# EAGLE design Display (EAGLE 7.1.0)
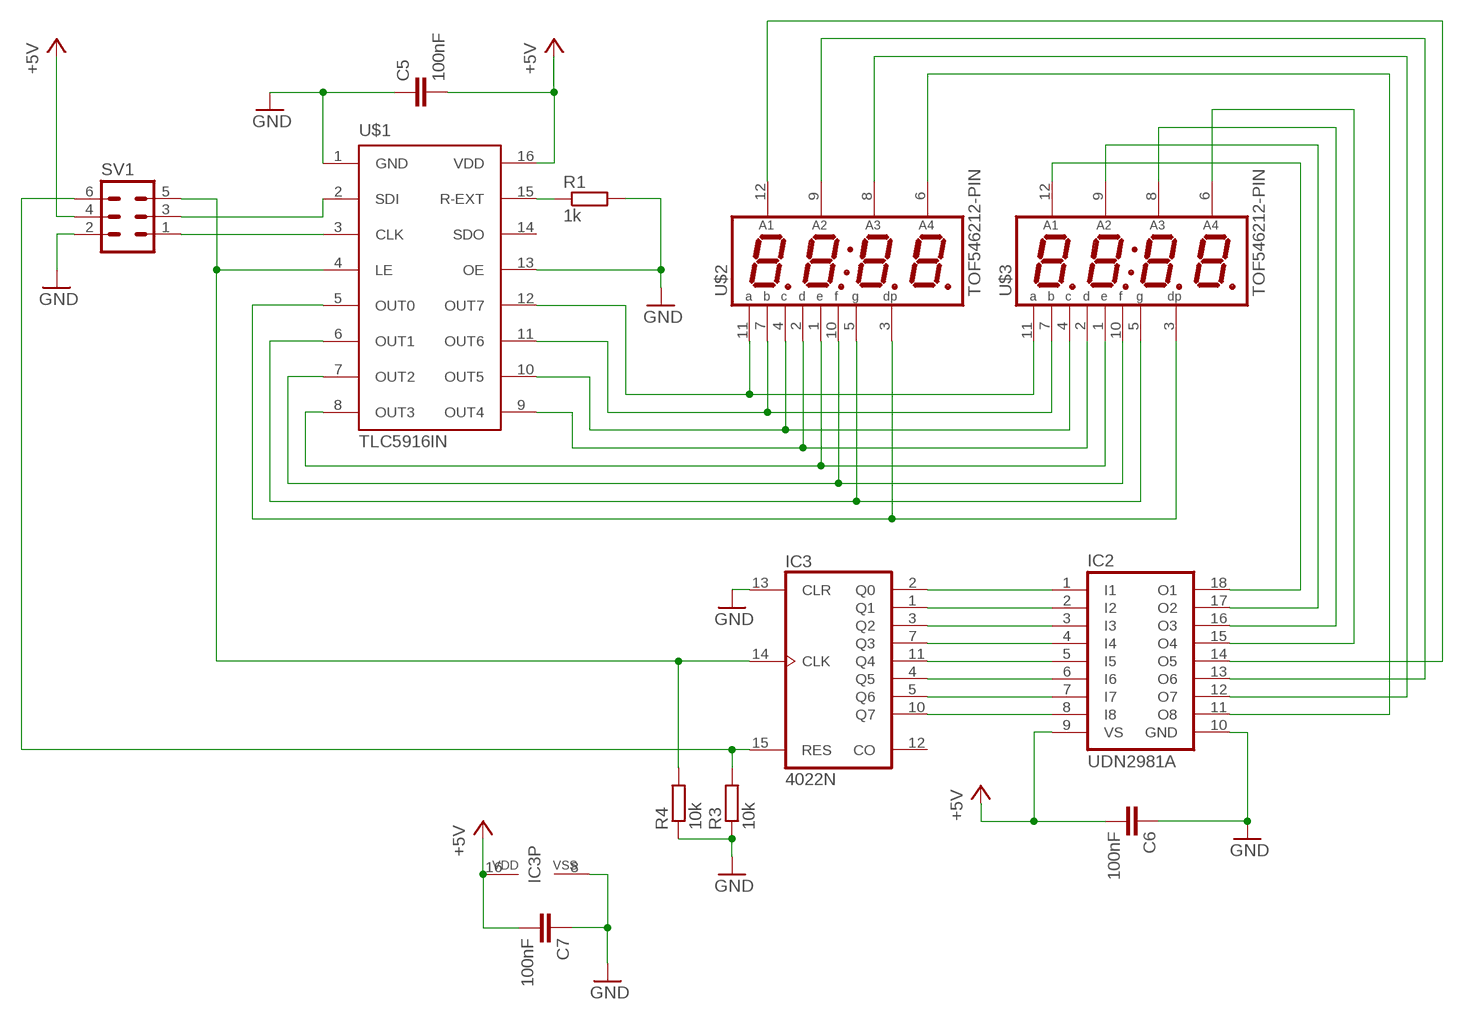
[diagram p0: schematic, sheet 1]

## Parts
C5  100nF  C-EU025-024X044  [C025-024X044]
C6  100nF  C-EU025-024X044  [C025-024X044]
C7  100nF  C-EU025-024X044  [C025-024X044]
IC2  UDN2981A  [DIL18]
IC3  4022N  [DIL16]
R1  1k  R-EU_0204/7  [0204/7]
R3  10k  R-EU_0204/2V  [0204V]
R4  10k  R-EU_0204/2V  [0204V]
SV1  ML6L  [ML6L]
U$1  TLC5916IN  [DIL16]
U$2  TOF546212-PIN  [TOF5462*]
U$3  TOF546212-PIN  [TOF5462*]

## Nets
+5V: C5.2 C6.2 C7.2 IC2.9(VS) IC3.16(VDD) SV1.4 U$1.16(VDD)
CLOCK: SV1.1 U$1.3(CLK)
DATA: SV1.3 U$1.2(SDI)
GND: C5.1 C6.1 C7.1 IC2.10(GND) IC3.8(VSS) IC3.13(CLR) R1.2 R3.1 R4.1 SV1.2 U$1.1(GND) U$1.13(OE)
LATCH: IC3.14(CLK) R4.2 SV1.5 U$1.4(LE)
N$1: U$1.11(OUT6) U$2.7(B) U$3.7(B)
N$2: IC2.17(O2) U$3.9(A2)
N$3: U$1.10(OUT5) U$2.4(C) U$3.4(C)
N$4: U$1.9(OUT4) U$2.2(D) U$3.2(D)
N$5: R1.1 U$1.15(R-EXT)
N$6: U$1.8(OUT3) U$2.1(E) U$3.1(E)
N$7: U$1.7(OUT2) U$2.10(F) U$3.10(F)
N$8: U$1.6(OUT1) U$2.5(G) U$3.5(G)
N$9: U$1.5(OUT0) U$2.3(DP) U$3.3(DP)
N$10: IC2.1(I1) IC3.2(Q0)
N$11: IC2.2(I2) IC3.1(Q1)
N$12: IC2.3(I3) IC3.3(Q2)
N$13: IC2.4(I4) IC3.7(Q3)
N$14: IC2.5(I5) IC3.11(Q4)
N$15: IC2.6(I6) IC3.4(Q5)
N$16: IC2.7(I7) IC3.5(Q6)
N$17: IC2.8(I8) IC3.10(Q7)
N$18: IC2.18(O1) U$3.12(A1)
N$19: IC2.14(O5) U$2.12(A1)
N$20: U$1.12(OUT7) U$2.11(A) U$3.11(A)
N$21: IC2.13(O6) U$2.9(A2)
N$22: IC2.16(O3) U$3.8(A3)
N$23: IC2.12(O7) U$2.8(A3)
N$24: IC2.15(O4) U$3.6(A4)
N$25: IC2.11(O8) U$2.6(A4)
RESET: IC3.15(RES) R3.2 SV1.6
Unconnected: IC3.12(CO) U$1.14(SDO)

## Library data of the parts
C5-C7 = rcl:C-EU: CAPACITOR, European symbol
IC2 = uln-udn:UDN298*: DRIVER ARRAY Source: Allegro Microsystems Inc. / UDN2981-UDN2984.pdf
IC3 = 40xx:4022: Divide-by 8 COUNTER
R1 R3 R4 = rcl:R-EU_: RESISTOR, European symbol
SV1 = con-harting-ml:ML6: HARTING; OC_FARNELL: unknown; OC_NEWARK: unknown
U$1 = zlalanne:TLC5916: TLC5916 8-Channel Constant-Current LED Sink Drivers Datasheet <http://www.ti.com/lit/ds/symlink/tlc5916.pdf>
U$2 U$3 = TOF5462:TOF5462

## Board
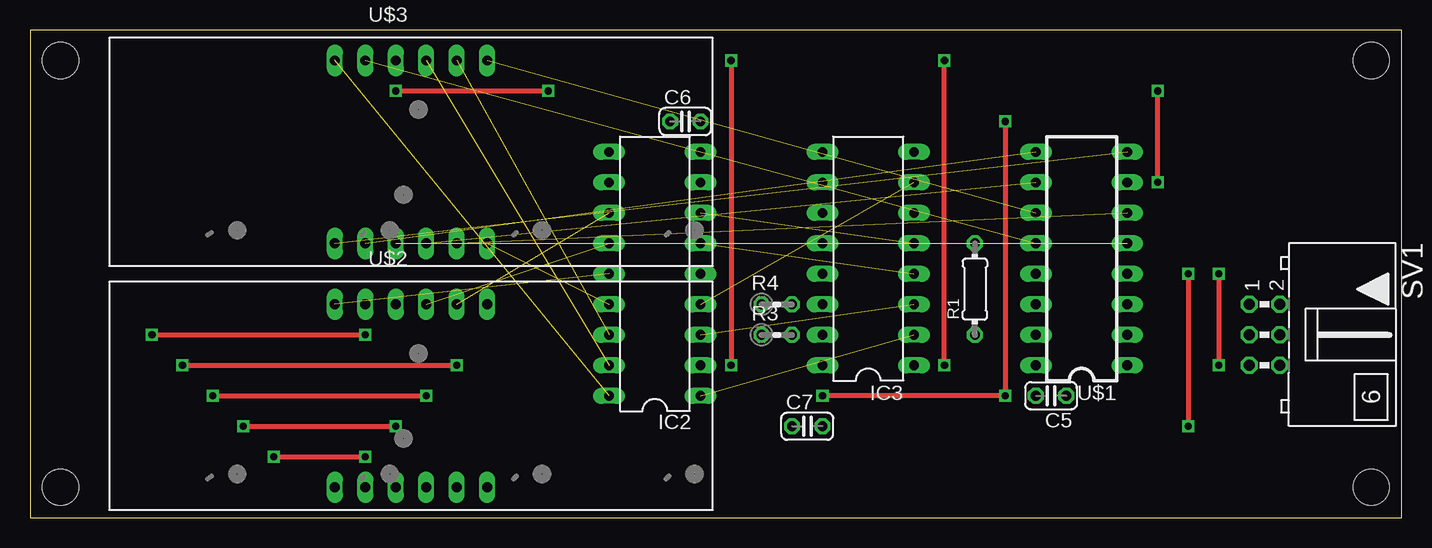
[diagram p1: board, top side]
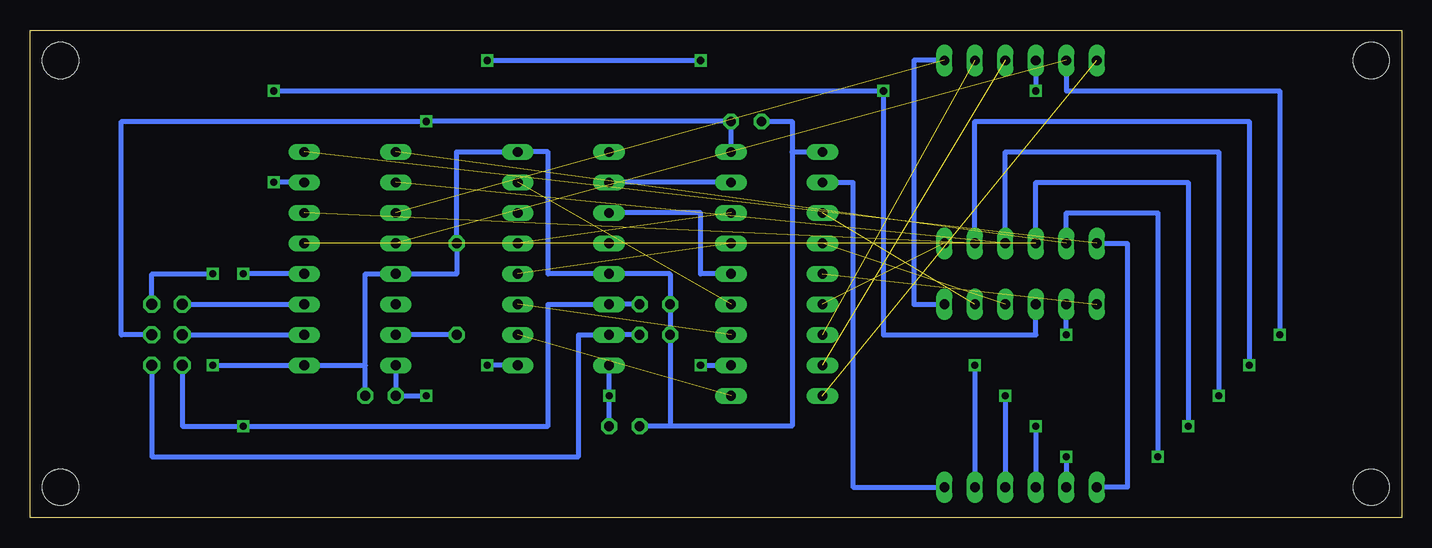
[diagram p2: board, bottom side, seen from below]

Size 114.3 x 40.64 mm. Coordinates in mm from the lower left corner, seen from the top.
Outline: 0,0 114.3,0 114.3,40.64 0,40.64 0,0
Copper layers (1*16): Top 0.035mm / dielectric 1.5mm / Bottom 0.035mm
Design rules "default": minimum track width 10mil, minimum drill 24mil, track to track 8mil, track to pad 8mil, pad to pad 8mil, via to via 8mil, smd to smd 8mil, copper to edge 40mil, drill to drill 8mil, minimum pad ring 10mil, minimum via ring 8mil, stop-mask expansion 4mil, vias tented up to drill 0mil, thermal gap 10mil
Holes 3 mm at 2.54,38.1 2.54,2.54 111.76,2.54 111.76,38.1

### Footprints (pad centres in the part's own frame; a part is rotated, then mirrored left to right if it is on the bottom)
C025-024X044 = drill 0.813 octagon: 1 -1.27,0; 2 1.27,0
DIL18 = drill 0.813 long: 1 -10.16,-3.81; 2 -7.62,-3.81; 3 -5.08,-3.81; 4 -2.54,-3.81; 5 0,-3.81; 6 2.54,-3.81; 7 5.08,-3.81; 8 7.62,-3.81; 9 10.16,-3.81; 10 10.16,3.81; 11 7.62,3.81; 12 5.08,3.81; 13 2.54,3.81; 14 0,3.81; 15 -2.54,3.81; 16 -5.08,3.81; 17 -7.62,3.81; 18 -10.16,3.81
DIL16 = drill 0.813 long: 1 -8.89,-3.81; 2 -6.35,-3.81; 3 -3.81,-3.81; 4 -1.27,-3.81; 5 1.27,-3.81; 6 3.81,-3.81; 7 6.35,-3.81; 8 8.89,-3.81; 9 8.89,3.81; 10 6.35,3.81; 11 3.81,3.81; 12 1.27,3.81; 13 -1.27,3.81; 14 -3.81,3.81; 15 -6.35,3.81; 16 -8.89,3.81
0204/7 = drill 0.813 octagon: 1 -3.81,0; 2 3.81,0
0204V = drill 0.813 octagon: 1 -1.27,0; 2 1.27,0
ML6L = drill 0.914 octagon: 1 -2.54,-1.27; 2 -2.54,1.27; 3 0,-1.27; 4 0,1.27; 5 2.54,-1.27; 6 2.54,1.27
TOF5462* = drill 0.813 long: 1 -6.35,-7.62; 2 -3.81,-7.62; 3 -1.27,-7.62; 4 1.27,-7.62; 5 3.81,-7.62; 6 6.35,-7.62; 7 6.35,7.62; 8 3.81,7.62; 9 1.27,7.62; 10 -1.27,7.62; 11 -3.81,7.62; 12 -6.35,7.62

### Placement (x,y rotation side)
C5  85.09,10.16 180 top
C6  54.61,33.02 0 top
C7  64.77,7.62 0 top
IC2  52.07,20.32 90 top
IC3  69.85,21.59 90 top
R1  78.74,19.05 90 top
R3  62.23,15.24 0 top
R4  62.23,17.78 0 top
SV1  102.87,15.24 270 top
U$1  87.63,21.59 90 top
U$2  31.75,10.16 0 top
U$3  31.75,30.48 0 top

### Tracks (layer width: path | path; a pad name or v marks a point on that pad's centre or on a via)
+5V  (via drill 0.6)
  Top 0.406: v66.04,10.16 v81.28,10.16 v81.28,33.02
  Bottom 0.406: C7.2 v66.04,10.16 IC3.16 | U$1.16 C5.2 v81.28,10.16 | IC2.9 C6.2 v81.28,33.02 106.68,33.02 106.68,15.24 SV1.4
CLOCK
  Bottom 0.406: SV1.1 U$1.3
DATA
  Bottom 0.406: SV1.3 U$1.2
GND  (via drill 0.6)
  Top 0.406: v99.06,20.32 v99.06,12.7
  Bottom 0.406: 50.8,30.48 50.8,33.02 C6.1 | 50.8,30.48 IC2.10 | 60.96,7.62 R3.1 R4.1 60.96,20.32 IC3.13 71.12,20.32 71.12,30.48 IC3.8 78.74,30.48 R1.2 78.74,20.32 U$1.13 86.36,20.32 86.36,12.7 | 60.96,7.62 C7.1 | SV1.2 104.14,20.32 v99.06,20.32 | v99.06,12.7 U$1.1 86.36,12.7 | C5.1 86.36,12.7 | 50.8,30.48 50.8,7.62 60.96,7.62
LATCH  (via drill 0.6)
  Top 0.406: v96.52,20.32 v96.52,7.62
  Bottom 0.406: R4.2 IC3.14 71.12,17.78 71.12,7.62 v96.52,7.62 101.6,7.62 SV1.5 | U$1.4 v96.52,20.32
N$1  (1 unrouted)
  Bottom 0.406: U$3.7 40.64,38.1 40.64,17.78 U$2.7
N$2  (1 unrouted)
N$3  (via drill 0.6)  (1 unrouted)
  Top 0.406: v15.24,10.16 v33.02,10.16
  Bottom 0.406: U$3.4 33.02,30.48 15.24,30.48 v15.24,10.16 | v33.02,10.16 U$2.4
N$4  (via drill 0.6)  (1 unrouted)
  Top 0.406: v20.32,5.08 v27.94,5.08
  Bottom 0.406: U$3.2 27.94,25.4 20.32,25.4 v20.32,5.08 | v27.94,5.08 U$2.2
N$5
  Bottom 0.406: R1.1 U$1.15
N$6  (1 unrouted)
  Bottom 0.406: U$3.1 22.86,22.86 22.86,2.54 U$2.1
N$7  (via drill 0.6)
  Top 0.406: v30.48,35.56 v43.18,35.56 | v93.98,27.94 v93.98,35.56
  Bottom 0.406: U$3.10 v30.48,35.56 | U$2.10 30.48,15.24 43.18,15.24 v43.18,35.56 v93.98,35.56 | U$1.7 v93.98,27.94
N$8  (via drill 0.6)  (1 unrouted)
  Top 0.406: v12.7,12.7 v35.56,12.7
  Bottom 0.406: U$3.5 35.56,33.02 12.7,33.02 v12.7,12.7 | v35.56,12.7 U$2.5
N$9  (via drill 0.6)  (1 unrouted)
  Top 0.406: v17.78,7.62 v30.48,7.62
  Bottom 0.406: U$3.3 30.48,27.94 17.78,27.94 v17.78,7.62 | v30.48,7.62 U$2.3
N$10  (1 unrouted)
N$11  (via drill 0.6)
  Top 0.406: v76.2,12.7 v76.2,38.1 | v58.42,38.1 v58.42,12.7
  Bottom 0.406: IC3.1 v76.2,12.7 | v76.2,38.1 v58.42,38.1 | v58.42,12.7 IC2.2
N$12  (1 unrouted)
N$13  (1 unrouted)
N$14
  Bottom 0.406: IC2.5 58.42,20.32 58.42,25.4 IC3.11
N$15  (1 unrouted)
N$16  (1 unrouted)
N$17
  Bottom 0.406: IC2.8 IC3.10
N$18  (1 unrouted)
N$19  (1 unrouted)
N$20  (via drill 0.6)  (1 unrouted)
  Top 0.406: v10.16,15.24 v27.94,15.24
  Bottom 0.406: U$3.11 27.94,35.56 10.16,35.56 v10.16,15.24 | v27.94,15.24 U$2.11
N$21  (1 unrouted)
N$22  (1 unrouted)
N$23  (1 unrouted)
N$24  (1 unrouted)
N$25
  Bottom 0.406: IC2.11 45.72,27.94 45.72,2.54 U$2.6
RESET
  Bottom 0.406: R3.2 IC3.15 68.58,15.24 68.58,5.08 104.14,5.08 SV1.6